# Altium schematic sheet HL1102.SchDoc
size 209 x 297 mm; Address1: Address1; Address2: Address2; Address3: Address3; Address4: Address4; SheetNumber: 1; Scale: 1:1; Разраб.: Иванов; Обозначение документа: АБВГ.123456.001 Э3; Пров.: Петров; Утв.: Сидоров; Наименование организации: ОАО "Концерн "МПО-Гидроприбор"; Перв. применение: АБВГ.123456.000; Наименование изделия 1: Плата; Наименование изделия 2: Схема электрическая; Наименование изделия 3: принципиальная; Нач. отд.: Нач. отд.; Фамилия нач. отд.: Сидоров
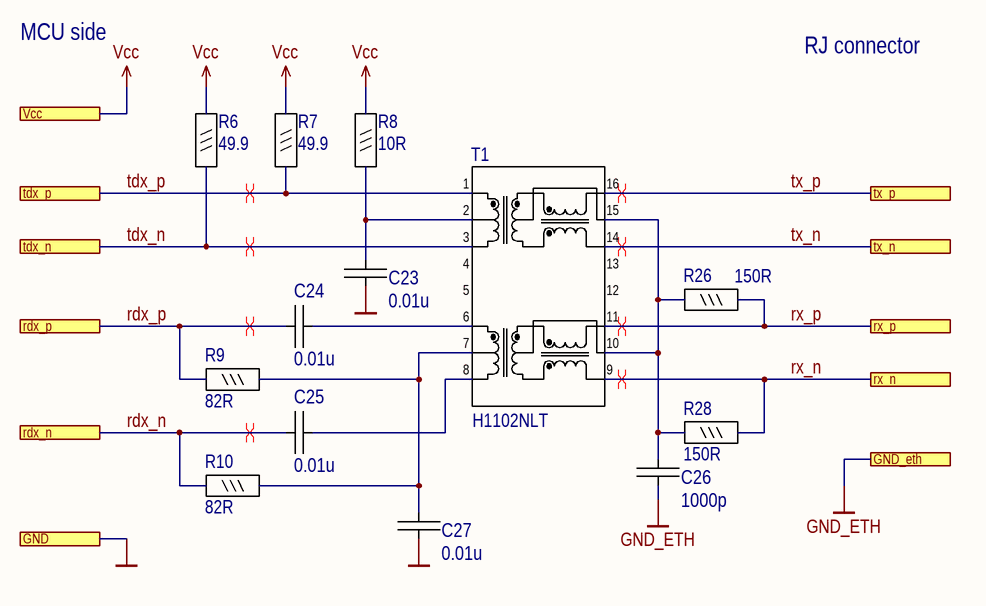
[diagram p0: HL1102.SchDoc]

## Parts
C23  0.01u  [C0603_IPC]
C24  0.01u  [C0603_IPC]
C25  0.01u  [C0603_IPC]
C26  1000p  [C1206_IPC]
C27  0.01u  [C0603_IPC]
R6  49.9  [R0603]
R7  49.9  [R0603]
R8  10R  [R0603]
R9  82R  [R0603]
R10  82R  [R0603]
R26  150R  [R0603]
R28  150R  [R0603]
T1  H1102NLT  [H1102NLT]

## Ports
GND, GND_eth, rdx_n, rdx_p, rx_n, rx_p, tdx_n, tdx_p, tx_n, tx_p, Vcc

## Nets
GND: C23.1 C27.1 ; port GND
GND_ETH: C26.2 ; port GND_eth
Vcc: R6.2 R7.2 R8.2 ; port Vcc
rdx_n: C25.1 R10.1 ; port rdx_n
rdx_p: C24.1 R9.1 ; port rdx_p
rx_n: R28.2 T1.9 ; port rx_n
rx_p: R26.2 T1.11 ; port rx_p
tdx_n: R6.1 T1.3 ; port tdx_n
tdx_p: R7.1 T1.1 ; port tdx_p
tx_n: T1.14 ; port tx_n
tx_p: T1.16 ; port tx_p
NetC23_2: C23.2 R8.1 T1.2
NetC24_2: C24.2 T1.6
NetC25_2: C25.2 T1.8
NetC26_1: C26.1 R26.1 R28.1 T1.10 T1.15
NetC27_2: C27.2 R9.2 R10.2 T1.7

Not connected (* = marked no-connect by the designer): T1 4 5 12 13

## Layout directives
differential pair: rdx_n, rdx_p, rx_n, rx_p, tdx_n, tdx_p, tx_n, tx_p

## Notes on the sheet
- MCU side
- RJ connector
- Перв. примен.
- Справ. №
- Подп. и дата
- Инв. № дубл.
- Взам. инв. №
- Разраб.
- Изм.
- Лист
- № докум.
- Подп.
- Дата
- Лит.
- Масса
- Масштаб
- Пров.
- Т.контр.
- Листов
- Инв. № подл.
- Утв.
- Н.контр.
- Копировал
- Формат А4

## Library data of the parts
C23-C25 C27 = 0.01u 50V: 0.01uF ±10% 50V Ceramic Capacitor X7R 0603 (1608 Metric); MPN: CC0603KRX7R9BB103; Manufacturer: Yageo; Tolerance: 0.1; PartNumber: 0.01u 50V; Value: 0.01u; Voltage/Power: 50V; LibraryPath: _library\sch\cap.schlib; FootprintPath: _library\pcb\capSmd.pcblib; ComponentLink2URL: https://www.digikey.com/product-detail/en/yageo/CC0603KRX7R9BB103/311-1085-2-ND/302819; ComponentLink2Description: site; Type: X7R; price elitan 1000pc: 0.54; price terra 1000pc: 0.62
C26 = 1000p 2kV: 1000pF ±5% 2000V (2kV) Ceramic Capacitor C0G, NP0 1206 (3216 Metric); MPN: CC1206KKX7RDBB102; Manufacturer: Yageo; Tolerance: 0.05; analogue: 1206GC102KAT1A; PartNumber: 1000p 2kV; Value: 1000p; Voltage/Power: 2kV; ComponentLink2URL: https://www.digikey.com/product-detail/en/yageo/CC1206KKX7RDBB102/311-1487-2-ND/2833652; ComponentLink2Description: site; Type: NP0; price elitan 1000pc: 3.49; price terra 1000pc: 2.1; price chipdip 1000pc: 4.1; LibraryPath: _library\sch\cap.schlib; FootprintPath: _library\pcb\capSmd.pcblib
R6 R7 = 49R9 1%: 49.9 Ohms ±1% 0.1W, 1/10W Chip Resistor 0603 (1608 Metric) Moisture Resistant Thick Film; MPN: RC0603FR-0749R9L; Manufacturer: yageo; Name: 49R9 1%; Voltage/Power: 0.063; Value: 49.9; Tolerance: 1%; ComponentLink2URL: https://www.digikey.com/product-detail/en/yageo/RC0603FR-0749R9L/311-49.9HRTR-ND/727264; ComponentLink2Description: site; price elitan 1000pc: 0.14; price chipdip 1000pc: 0.4; LibraryPath: sch\res.Schlib; FootprintPath: pcb\resSmd.pcblib
R8 = 10R 1%: 10 Ohms ±1% 0.1W, 1/10W Chip Resistor 0603 (1608 Metric) Moisture Resistant Thick Film; MPN: RC0603FR-0710RL; Manufacturer: yageo; Name: 10R 1%; Voltage/Power: 0.063; Value: 10R; Tolerance: 1%; ComponentLink2URL: https://www.digikey.com/product-detail/en/yageo/RC0603FR-0710RL/311-10.0HRTR-ND/726879; ComponentLink2Description: site; price elitan 1000pc: 0.23; price chipdip 1000pc: 0.7; LibraryPath: sch\res.Schlib; FootprintPath: pcb\resSmd.pcblib
R9 R10 = 82R 1%: 82 Ohms ±1% 0.1W, 1/10W Chip Resistor 0603 (1608 Metric) Moisture Resistant Thick Film; MPN: RC0603FR-0782RL; Manufacturer: yageo; Name: 82R 1%; Voltage/Power: 0.063; Value: 82R; Tolerance: 1%; ComponentLink2URL: https://www.digikey.com/product-detail/en/yageo/RC0603FR-0782RL/311-82.0HRTR-ND/727399; ComponentLink2Description: site; price elitan 1000pc: 0.13; price terra 1000pc: 0.18; price chipdip 1000pc: 0.7; LibraryPath: sch\res.Schlib; FootprintPath: pcb\resSmd.pcblib
R26 R28 = 150R 1%: 150 Ohms ±1% 0.1W, 1/10W Chip Resistor 0603 (1608 Metric) Moisture Resistant Thick Film; MPN: RC0603FR-07150RL; Manufacturer: yageo; Name: 150R 1%; Voltage/Power: 0.063; Value: 150R; Tolerance: 1%; ComponentLink2URL: https://www.digikey.com/product-detail/en/yageo/RC0603FR-07150RL/311-150HRTR-ND/726958; ComponentLink2Description: site; price elitan 1000pc: 0.13; price chipdip 1000pc: 0.7; LibraryPath: sch\res.Schlib; FootprintPath: pcb\resSmd.pcblib
T1 = H1102NLT: Isolation and Data Interface (Encapsulated) Pulse Transformer 1:1 Transmitter, 1:1 Receiver Surface Mount; Manufacturer: Pulse Electronics Network; Name: H1102NLT; MPN: H1102NLT; ComponentLink2URL: https://www.digikey.com/product-detail/en/pulse-electronics-network/H1102NLT/553-1532-2-ND/2265467; ComponentLink2Description: site; price elitan 1000pc: 42.6; price terra 1000pc: 71.38; price chipdip 1000pc: 50.9; LibraryPath: _library\sch\transistors.schlib; FootprintPath: _library\pcb\transistors.pcblib